# EAGLE design rgb (EAGLE 7.5.0)
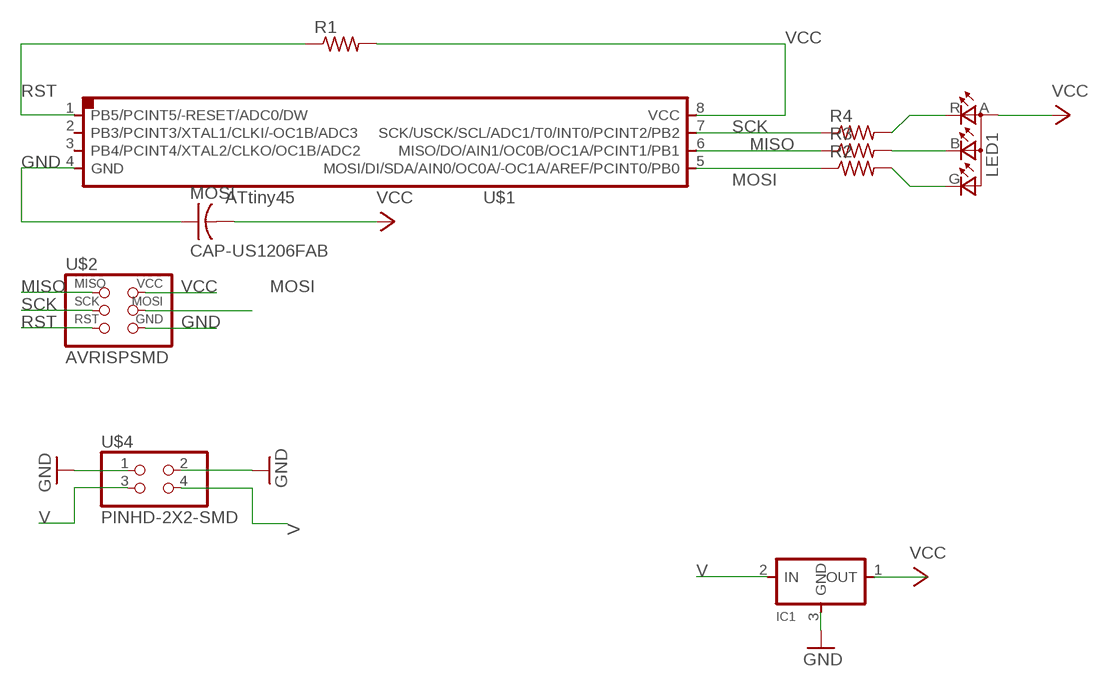
[diagram p0: schematic, sheet 1]

## Parts
IC1  REGULATORSOT23  [SOT23]
LED1  LEDRGBOLD  [P-LCC-4-3]
MOSI  CAP-US1206FAB  [C1206FAB]
R1  RES-US1206FAB  [R1206FAB]
R2  RES-US1206FAB  [R1206FAB]
R3  RES-US1206FAB  [R1206FAB]
R4  RES-US1206FAB  [R1206FAB]
U$1  ATTINY45SI  [SOIC8]
U$2  AVRISPSMD  [2X03SMD]
U$4  PINHD-2X2-SMD  [2X02SMD]

## Nets
GND: IC1.3(GND) MOSI.1 U$1.4(GND) U$2.6(GND) U$4.1 U$4.2
MISO: R3.1 U$1.6(MISO/DO/AIN1/OC0B/OC1A/PCINT1/PB1) U$2.1(MISO)
MOSI: R2.1 U$1.5(MOSI/DI/SDA/AIN0/OC0A/-OC1A/AREF/PCINT0/PB0) U$2.4(MOSI)
N$2: LED1.R(CRED) R4.2
N$3: LED1.G(CGREEN) R2.2
N$4: LED1.B(CBLUE) R3.2
N$5: IC1.1(OUT)
RST: R1.1 U$1.1(PB5/PCINT5/-RESET/ADC0/DW) U$2.5(RST)
SCK: R4.1 U$1.7(SCK/USCK/SCL/ADC1/T0/INT0/PCINT2/PB2) U$2.3(SCK)
V: IC1.2(IN) U$4.3 U$4.4
VCC: LED1.A(A2) MOSI.2 R1.2 U$1.8(VCC) U$2.2(VCC)
Unconnected: U$1.2(PB3/PCINT3/XTAL1/CLKI/-OC1B/ADC3) U$1.3(PB4/PCINT4/XTAL2/CLKO/OC1B/ADC2)

## Library data of the parts
IC1 = fab:REGULATOR
LED1 = fab:LEDRGBOLD: OSRAM Hyper Multi TOPLED® Hyper-Bright LED LATB T686 Source: http://www.osram.convergy.de/
MOSI = fab:CAP-US
R1-R4 = fab:RES-US: Resistor (US Symbol) Variants with postfix FAB are widened to allow the routing of internal traces
U$1 = fab:ATTINY45
U$2 = fab:AVRISP
U$4 = fab:PINHD-2X2-SMD

## Board
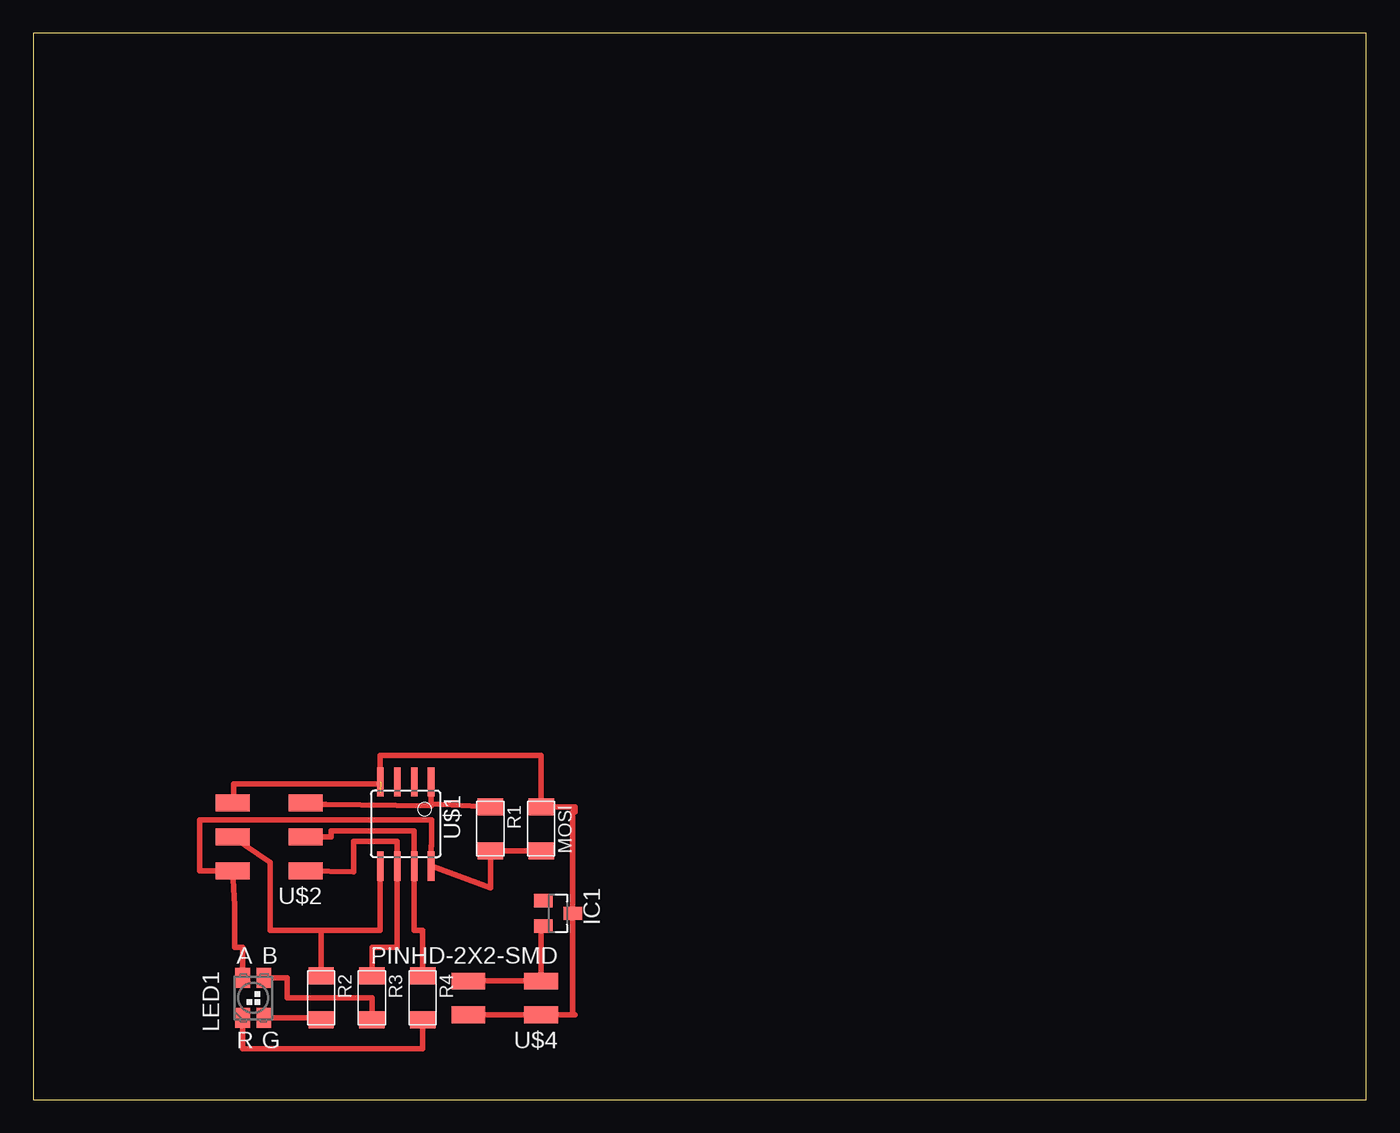
[diagram p1: board, top side]

Size 100 x 80 mm. Coordinates in mm from the lower left corner, seen from the top.
Outline: 0,0 100,0 100,80 0,80 0,0
Copper layers (1*16): Top 0.035mm / dielectric 1.5mm / Bottom 0.035mm
Design rules "default *": minimum track width 16mil, minimum drill 24mil, track to track 16mil, track to pad 16mil, pad to pad 16mil, via to via 16mil, smd to smd 16mil, copper to edge 40mil, drill to drill 8mil, minimum pad ring 10mil, minimum via ring 8mil, stop-mask expansion 4mil, vias tented up to drill 0mil, thermal gap 10mil

### Footprints (pad centres in the part's own frame; a part is rotated, then mirrored left to right if it is on the bottom)
SOT23 = smd 1 x 1.4: 1 -0.95,-1.1; 2 0.95,-1.1; 3 0,1.1
P-LCC-4-3 = smd 1.1 x 1.5: A -0.8,1.5; B 0.8,1.5; G 0.8,-1.5; R -0.8,-1.5
C1206FAB = smd 1.27 x 1.905: 1 -1.651,0; 2 1.651,0
R1206FAB = smd 1.27 x 1.905: 1 -1.651,0; 2 1.651,0
SOIC8 = smd 0.5 x 2.2: 1 -1.905,-3.154; 2 -0.645,-3.154; 3 0.625,-3.154; 4 1.895,-3.154; 5 1.905,3.154; 6 0.635,3.154; 7 -0.635,3.154; 8 -1.905,3.154
2X03SMD = smd 2.54 x 1.27: 1 -2.54,2.54; 2 2.92,2.54; 3 -2.54,0; 4 2.92,0; 5 -2.54,-2.54; 6 2.92,-2.54
2X02SMD = smd 2.54 x 1.27: 1 -2.54,1.27; 2 2.92,1.27; 3 -2.54,-1.27; 4 2.92,-1.27

### Placement (x,y rotation side)
IC1  39.37,13.97 270 top
LED1  16.51,7.62 0 top
MOSI  38.1,20.32 270 top
R1  34.29,20.32 270 top
R2  21.59,7.62 270 top
R3  25.4,7.62 270 top
R4  29.21,7.62 270 top
U$1  27.94,20.68 180 top
U$2  17.88,19.71 180 top
U$4  35.56,7.62 180 top

### Tracks (layer width: path | path; a pad name or v marks a point on that pad's centre or on a via)
GND  (1 unrouted)
  Top 0.406: U$2.6 15.04,22.35 15.04,23.67 25.84,23.67 U$1.4 | 26.04,23.02 26.04,25.81 38.1,25.81 MOSI.1 40.64,21.97 40.64,21.59 40.47,21.59 IC1.3 40.47,6.35 | U$4.2 U$4.1 40.47,6.35 | 40.64,6.35 40.47,6.35
MISO
  Top 0.406: R3.1 25.4,11.43 27.3,11.43 U$1.6 27.3,19.36 24.03,19.36 24.03,17.07 U$2.1
MOSI
  Top 0.406: R2.1 21.59,12.7 | 21.59,12.7 26.04,12.7 U$1.5 | U$2.4 17.78,17.78 17.78,12.7 21.59,12.7
N$2
  Top 0.406: R4.2 29.21,3.81 15.71,3.81 LED1.R
N$3
  Top 0.406: LED1.G 21.59,6.12 R2.2
N$4
  Top 0.406: LED1.B 19.05,9.12 19.05,7.62 25.4,7.62 R3.2
RST
  Top 0.406: R1.1 29.84,22.17 | 29.84,22.17 29.84,22.05 21.95,22.15 21.74,22.15 U$2.5 | 29.84,22.17 U$1.1
SCK
  Top 0.406: R4.1 29.21,12.7 28.57,12.7 U$1.7 28.57,20.17 22.35,20.17 22.35,19.71 U$2.3
V
  Top 0.406: U$4.4 U$4.3 38.1,13.02 IC1.2
VCC
  Top 0.406: MOSI.2 R1.2 34.29,15.9 U$1.8 29.84,19.05 29.87,19.05 29.87,20.98 12.5,20.98 12.5,17.17 U$2.2 15.09,14.58 15.09,11.43 15.71,11.43 LED1.A